# EasyEDA schematic audiobackboard.json
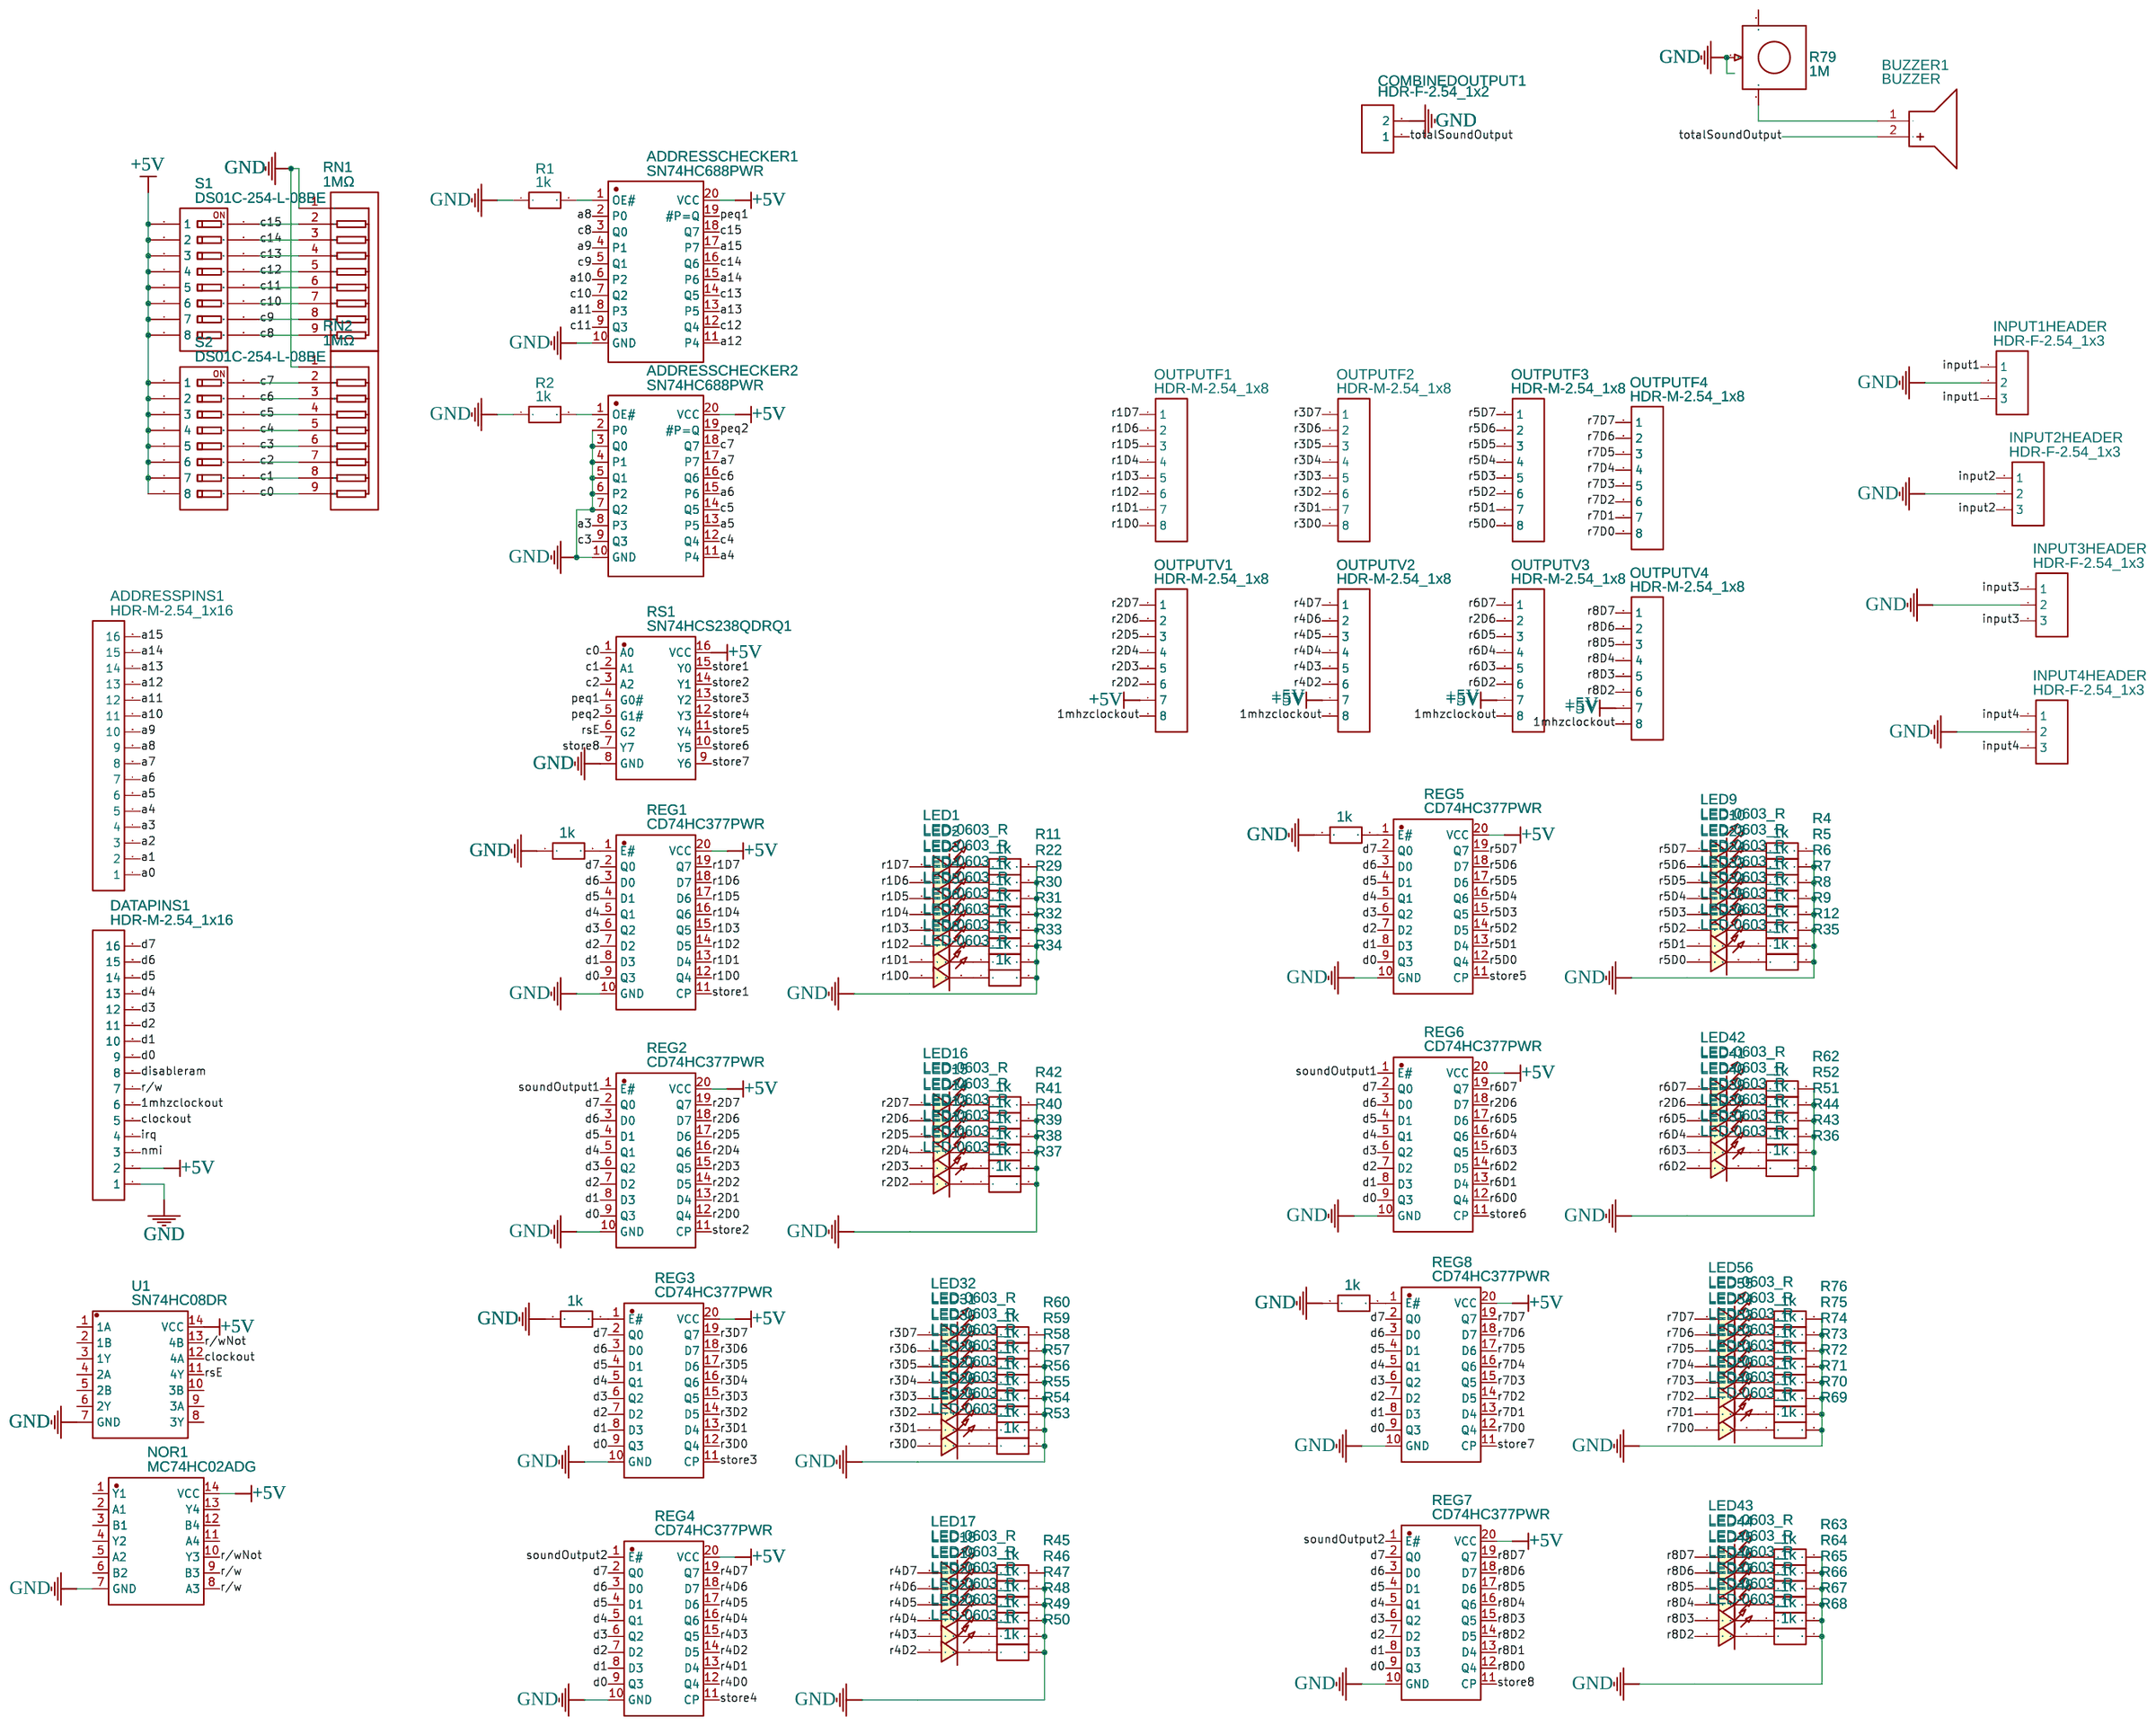
[diagram p0: schematic sheet]

## Parts
ADDRESSCHECKER1  SN74HC688PWR  [TSSOP-20_L6.5-W4.4-P0.65-LS6.4-BL]
ADDRESSCHECKER2  SN74HC688PWR  [TSSOP-20_L6.5-W4.4-P0.65-LS6.4-BL]
ADDRESSPINS1  HDR-M-2.54_1x16  [HDR-M-2.54_1X16]
BUZZER1  BUZZER  [BUZ-TH_BD12.0-P6.00-D0.9-RD]
COMBINEDOUTPUT1  HDR-F-2.54_1x2  [HDR-F-2.54_1X2]
DATAPINS1  HDR-M-2.54_1x16  [HDR-M-2.54_1X16]
INPUT1HEADER  HDR-F-2.54_1x3  [HDR-F-2.54_1X3]
INPUT2HEADER  HDR-F-2.54_1x3  [HDR-F-2.54_1X3]
INPUT3HEADER  HDR-F-2.54_1x3  [HDR-F-2.54_1X3]
INPUT4HEADER  HDR-F-2.54_1x3  [HDR-F-2.54_1X3]
LED1  LED-0603_R  [LED0603_RED]
LED2  LED-0603_R  [LED0603_RED]
LED3  LED-0603_R  [LED0603_RED]
LED4  LED-0603_R  [LED0603_RED]
LED5  LED-0603_R  [LED0603_RED]
LED6  LED-0603_R  [LED0603_RED]
LED7  LED-0603_R  [LED0603_RED]
LED8  LED-0603_R  [LED0603_RED]
LED9  LED-0603_R  [LED0603_RED]
LED10  LED-0603_R  [LED0603_RED]
LED11  LED-0603_R  [LED0603_RED]
LED12  LED-0603_R  [LED0603_RED]
LED13  LED-0603_R  [LED0603_RED]
LED14  LED-0603_R  [LED0603_RED]
LED15  LED-0603_R  [LED0603_RED]
LED16  LED-0603_R  [LED0603_RED]
LED17  LED-0603_R  [LED0603_RED]
LED18  LED-0603_R  [LED0603_RED]
LED19  LED-0603_R  [LED0603_RED]
LED20  LED-0603_R  [LED0603_RED]
LED21  LED-0603_R  [LED0603_RED]
LED22  LED-0603_R  [LED0603_RED]
LED23  LED-0603_R  [LED0603_RED]
LED24  LED-0603_R  [LED0603_RED]
LED25  LED-0603_R  [LED0603_RED]
LED26  LED-0603_R  [LED0603_RED]
LED27  LED-0603_R  [LED0603_RED]
LED28  LED-0603_R  [LED0603_RED]
LED29  LED-0603_R  [LED0603_RED]
LED30  LED-0603_R  [LED0603_RED]
LED31  LED-0603_R  [LED0603_RED]
LED32  LED-0603_R  [LED0603_RED]
LED33  LED-0603_R  [LED0603_RED]
LED34  LED-0603_R  [LED0603_RED]
LED35  LED-0603_R  [LED0603_RED]
LED36  LED-0603_R  [LED0603_RED]
LED37  LED-0603_R  [LED0603_RED]
LED38  LED-0603_R  [LED0603_RED]
LED39  LED-0603_R  [LED0603_RED]
LED40  LED-0603_R  [LED0603_RED]
LED41  LED-0603_R  [LED0603_RED]
LED42  LED-0603_R  [LED0603_RED]
LED43  LED-0603_R  [LED0603_RED]
LED44  LED-0603_R  [LED0603_RED]
LED45  LED-0603_R  [LED0603_RED]
LED46  LED-0603_R  [LED0603_RED]
LED47  LED-0603_R  [LED0603_RED]
LED48  LED-0603_R  [LED0603_RED]
LED49  LED-0603_R  [LED0603_RED]
LED50  LED-0603_R  [LED0603_RED]
LED51  LED-0603_R  [LED0603_RED]
LED52  LED-0603_R  [LED0603_RED]
LED53  LED-0603_R  [LED0603_RED]
LED54  LED-0603_R  [LED0603_RED]
LED55  LED-0603_R  [LED0603_RED]
LED56  LED-0603_R  [LED0603_RED]
NOR1  MC74HC02ADG  [SOIC-14_L8.7-W3.9-P1.27-LS6.0-BL]
OUTPUTF1  HDR-M-2.54_1x8  [HDR-M-2.54_1X8]
OUTPUTF2  HDR-M-2.54_1x8  [HDR-M-2.54_1X8]
OUTPUTF3  HDR-M-2.54_1x8  [HDR-M-2.54_1X8]
OUTPUTF4  HDR-M-2.54_1x8  [HDR-M-2.54_1X8]
OUTPUTV1  HDR-M-2.54_1x8  [HDR-M-2.54_1X8]
OUTPUTV2  HDR-M-2.54_1x8  [HDR-M-2.54_1X8]
OUTPUTV3  HDR-M-2.54_1x8  [HDR-M-2.54_1X8]
OUTPUTV4  HDR-M-2.54_1x8  [HDR-M-2.54_1X8]
R1  1k  [R1206]
R2  1k  [R1206]
R3  1k  [R1206]
R4  1k  [R1206]
R5  1k  [R1206]
R6  1k  [R1206]
R7  1k  [R1206]
R8  1k  [R1206]
R9  1k  [R1206]
R11  1k  [R1206]
R12  1k  [R1206]
R22  1k  [R1206]
R29  1k  [R1206]
R30  1k  [R1206]
R31  1k  [R1206]
R32  1k  [R1206]
R33  1k  [R1206]
R34  1k  [R1206]
R35  1k  [R1206]
R36  1k  [R1206]
R37  1k  [R1206]
R38  1k  [R1206]
R39  1k  [R1206]
R40  1k  [R1206]
R41  1k  [R1206]
R42  1k  [R1206]
R43  1k  [R1206]
R44  1k  [R1206]
R45  1k  [R1206]
R46  1k  [R1206]
R47  1k  [R1206]
R48  1k  [R1206]
R49  1k  [R1206]
R50  1k  [R1206]
R51  1k  [R1206]
R52  1k  [R1206]
R53  1k  [R1206]
R54  1k  [R1206]
R55  1k  [R1206]
R56  1k  [R1206]
R57  1k  [R1206]
R58  1k  [R1206]
R59  1k  [R1206]
R60  1k  [R1206]
R61  1k  [R1206]
R62  1k  [R1206]
R63  1k  [R1206]
R64  1k  [R1206]
R65  1k  [R1206]
R66  1k  [R1206]
R67  1k  [R1206]
R68  1k  [R1206]
R69  1k  [R1206]
R70  1k  [R1206]
R71  1k  [R1206]
R72  1k  [R1206]
R73  1k  [R1206]
R74  1k  [R1206]
R75  1k  [R1206]
R76  1k  [R1206]
R77  1k  [R1206]
R78  1k  [R1206]
R79  1M  [3386T]
REG1  CD74HC377PWR  [TSSOP-20_L6.5-W4.4-P0.65-LS6.4-BL]
REG2  CD74HC377PWR  [TSSOP-20_L6.5-W4.4-P0.65-LS6.4-BL]
REG3  CD74HC377PWR  [TSSOP-20_L6.5-W4.4-P0.65-LS6.4-BL]
REG4  CD74HC377PWR  [TSSOP-20_L6.5-W4.4-P0.65-LS6.4-BL]
REG5  CD74HC377PWR  [TSSOP-20_L6.5-W4.4-P0.65-LS6.4-BL]
REG6  CD74HC377PWR  [TSSOP-20_L6.5-W4.4-P0.65-LS6.4-BL]
REG7  CD74HC377PWR  [TSSOP-20_L6.5-W4.4-P0.65-LS6.4-BL]
REG8  CD74HC377PWR  [TSSOP-20_L6.5-W4.4-P0.65-LS6.4-BL]
RN1  1MΩ  [RES-ARRAY-TH_9P-P2.54-D1.0]
RN2  1MΩ  [RES-ARRAY-TH_9P-P2.54-D1.0]
RS1  SN74HCS238QDRQ1  [SOIC-16_L9.9-W3.9-P1.27-LS6.0-BL]
S1  DS01C-254-L-08BE  [DS01C-254-L-08BE]
S2  DS01C-254-L-08BE  [DS01C-254-L-08BE]
U1  SN74HC08DR  [SOIC-14_L8.7-W3.9-P1.27-LS6.0-BL]

## Library data of the parts
ADDRESSCHECKER1 ADDRESSCHECKER2 = SN74HC688PWR: Contributor: LCSC; Supplier: LCSC; Manufacturer: TI(德州仪器); Supplier Part: C132045; JLCPCB Part Class: Extended Part; link: https://lcsc.com/eda_search?q=C132045&%26type=1&ref=editor
ADDRESSPINS1 DATAPINS1 = HDR-M-2.54_1x16: Supplier: LCSC; Contributor: LCEDA_Lib
BUZZER1 = BUZZER: Contributor: lcsc; Supplier: LCSC; Supplier Part: C9900014030; Manufacturer: null; Manufacturer Part: buzzer; JLCPCB Part Class: Extended Part; link: https://lcsc.com/eda_search?q=C9900014030&%26type=1&ref=editor
COMBINEDOUTPUT1 = HDR-F-2.54_1x2: Supplier Part: C49661; Supplier: LCSC; Contributor: LCEDA_Lib
INPUT1HEADER INPUT2HEADER INPUT3HEADER INPUT4HEADER = HDR-F-2.54_1x3: Supplier Part: C146690; Supplier: LCSC; Contributor: LCEDA_Lib
LED1-LED56 = LED-0603_R: Manufacturer: EVERLIGHT(台湾亿光); Manufacturer Part: 19-217/R6C-AL1M2VY/3T; Supplier Part: C72044; Supplier: LCSC; Contributor: LCEDA_01
NOR1 = MC74HC02ADG: Contributor: LCSC; Supplier: LCSC; Supplier Part: C233598; Manufacturer: onsemi(安森美); JLCPCB Part Class: Extended Part; link: https://lcsc.com/eda_search?q=C233598&%26type=1&ref=editor
OUTPUTF1-OUTPUTF4 OUTPUTV1-OUTPUTV4 = HDR-M-2.54_1x8: Supplier Part: C190820; Supplier: LCSC; Contributor: LCEDA_Lib
R1-R9 R11 R12 R22 R29-R78 = R_1206_EU: Contributor: LCEDA_Lib
R79 = 3/8 Inch Square Cermet Potentiometer 1MEG Ohms 1/2 Watt 1 Turn Thru Hole: Manufacturer: Jameco ValuePro; Manufacturer Part: 3386T-1-LS1MEG(105); Supplier Part: 2161422; link: https://www.jameco.com/webapp/wcs/stores/servlet/ProductDisplay?storeId=10001&langId=-1&catalogId=10001&productId=2161422; Contributor: dissy614
REG1-REG8 = CD74HC377PWR: Contributor: LCSC; Supplier: LCSC; Supplier Part: C2677832; Manufacturer: TI(德州仪器); JLCPCB Part Class: Extended Part; link: https://lcsc.com/eda_search?q=C2677832&%26type=1&ref=editor
RN1 RN2 = 4609X-101-105LF: Supplier: LCSC; Supplier Part: C1358086; Manufacturer: BOURNS; JLCPCB Part Class: Extended Part; Contributor: lcsc
RS1 = SN74HCS238QDRQ1: Contributor: lcsc; Supplier: LCSC; Supplier Part: C2878562; Manufacturer: TI(德州仪器); link: https://lcsc.com/eda_search?q=C2878562&%26type=1&ref=editor
S1 S2 = DS01C-254-L-08BE: Manufacturer: CUI Devices; Manufacturer Part: DS01C-254-L-07BE; Supplier: Mouser; Supplier Part: 490-DS01C-254-L-07BE; link: https://www.mouser.com/datasheet/2/670/ds01-254-1777712.pdf; Contributor: CK Sim
U1 = SN74HC08DR: Contributor: LCSC; Supplier: LCSC; Supplier Part: C337768; Manufacturer: TI(德州仪器); JLCPCB Part Class: Extended Part; link: https://lcsc.com/eda_search?q=C337768&%26type=1&ref=editor

## Nets
+5V: ADDRESSCHECKER1.20(VCC) ADDRESSCHECKER2.20(VCC) DATAPINS1.2 NOR1.14(VCC) OUTPUTV1.7 OUTPUTV2.7 OUTPUTV3.7 OUTPUTV4.7 REG1.20(VCC) REG2.20(VCC) REG3.20(VCC) REG4.20(VCC) REG5.20(VCC) REG6.20(VCC) REG7.20(VCC) REG8.20(VCC) RS1.16(VCC) S1.1 S1.2 S1.3 S1.4 S1.5 S1.6 S1.7 S1.8 S2.1 S2.2 S2.3 S2.4 S2.5 S2.6 S2.7 S2.8 U1.14(VCC)
GND: ADDRESSCHECKER1.10(GND) ADDRESSCHECKER2.2(P0) ADDRESSCHECKER2.3(Q0) ADDRESSCHECKER2.4(P1) ADDRESSCHECKER2.5(Q1) ADDRESSCHECKER2.6(P2) ADDRESSCHECKER2.7(Q2) ADDRESSCHECKER2.10(GND) COMBINEDOUTPUT1.2 DATAPINS1.1 INPUT1HEADER.2 INPUT2HEADER.2 INPUT3HEADER.2 INPUT4HEADER.2 NOR1.7(GND) R1.1 R2.1 R3.1 R4.2 R5.2 R6.2 R7.2 R8.2 R9.2 R11.2 R12.2 R22.2 R29.2 R30.2 R31.2 R32.2 R33.2 R34.2 R35.2 R36.2 R37.2 R38.2 R39.2 R40.2 R41.2 R42.2 R43.2 R44.2 R45.2 R46.2 R47.2 R48.2 R49.2 R50.2 R51.2 R52.2 R53.2 R54.2 R55.2 R56.2 R57.2 R58.2 R59.2 R60.2 R61.1 R62.2 R63.2 R64.2 R65.2 R66.2 R67.2 R68.2 R69.2 R70.2 R71.2 R72.2 R73.2 R74.2 R75.2 R76.2 R77.1 R78.1 R79.2 REG1.10(GND) REG2.10(GND) REG3.10(GND) REG4.10(GND) REG5.10(GND) REG6.10(GND) REG7.10(GND) REG8.10(GND) RN1.1 RN2.1 RS1.8(GND) U1.7(GND)
1mhzclockout: DATAPINS1.6 OUTPUTV1.8 OUTPUTV2.8 OUTPUTV3.8 OUTPUTV4.8
a0: ADDRESSPINS1.1
a1: ADDRESSPINS1.2
a2: ADDRESSPINS1.3
a3: ADDRESSCHECKER2.8(P3) ADDRESSPINS1.4
a4: ADDRESSCHECKER2.11(P4) ADDRESSPINS1.5
a5: ADDRESSCHECKER2.13(P5) ADDRESSPINS1.6
a6: ADDRESSCHECKER2.15(P6) ADDRESSPINS1.7
a7: ADDRESSCHECKER2.17(P7) ADDRESSPINS1.8
a8: ADDRESSCHECKER1.2(P0) ADDRESSPINS1.9
a9: ADDRESSCHECKER1.4(P1) ADDRESSPINS1.10
a10: ADDRESSCHECKER1.6(P2) ADDRESSPINS1.11
a11: ADDRESSCHECKER1.8(P3) ADDRESSPINS1.12
a12: ADDRESSCHECKER1.11(P4) ADDRESSPINS1.13
a13: ADDRESSCHECKER1.13(P5) ADDRESSPINS1.14
a14: ADDRESSCHECKER1.15(P6) ADDRESSPINS1.15
a15: ADDRESSCHECKER1.17(P7) ADDRESSPINS1.16
c0: RN2.9 RS1.1(A0) S2.9
c1: RN2.8 RS1.2(A1) S2.10
c2: RN2.7 RS1.3(A2) S2.11
c3: ADDRESSCHECKER2.9(Q3) RN2.6 S2.12
c4: ADDRESSCHECKER2.12(Q4) RN2.5 S2.13
c5: ADDRESSCHECKER2.14(Q5) RN2.4 S2.14
c6: ADDRESSCHECKER2.16(Q6) RN2.3 S2.15
c7: ADDRESSCHECKER2.18(Q7) RN2.2 S2.16
c8: ADDRESSCHECKER1.3(Q0) RN1.9 S1.9
c9: ADDRESSCHECKER1.5(Q1) RN1.8 S1.10
c10: ADDRESSCHECKER1.7(Q2) RN1.7 S1.11
c11: ADDRESSCHECKER1.9(Q3) RN1.6 S1.12
c12: ADDRESSCHECKER1.12(Q4) RN1.5 S1.13
c13: ADDRESSCHECKER1.14(Q5) RN1.4 S1.14
c14: ADDRESSCHECKER1.16(Q6) RN1.3 S1.15
c15: ADDRESSCHECKER1.18(Q7) RN1.2 S1.16
clockout: DATAPINS1.5 U1.12(4A)
d0: DATAPINS1.9 REG1.9(Q3) REG2.9(Q3) REG3.9(Q3) REG4.9(Q3) REG5.9(Q3) REG6.9(Q3) REG7.9(Q3) REG8.9(Q3)
d1: DATAPINS1.10 REG1.8(D3) REG2.8(D3) REG3.8(D3) REG4.8(D3) REG5.8(D3) REG6.8(D3) REG7.8(D3) REG8.8(D3)
d2: DATAPINS1.11 REG1.7(D2) REG2.7(D2) REG3.7(D2) REG4.7(D2) REG5.7(D2) REG6.7(D2) REG7.7(D2) REG8.7(D2)
d3: DATAPINS1.12 REG1.6(Q2) REG2.6(Q2) REG3.6(Q2) REG4.6(Q2) REG5.6(Q2) REG6.6(Q2) REG7.6(Q2) REG8.6(Q2)
d4: DATAPINS1.13 REG1.5(Q1) REG2.5(Q1) REG3.5(Q1) REG4.5(Q1) REG5.5(Q1) REG6.5(Q1) REG7.5(Q1) REG8.5(Q1)
d5: DATAPINS1.14 REG1.4(D1) REG2.4(D1) REG3.4(D1) REG4.4(D1) REG5.4(D1) REG6.4(D1) REG7.4(D1) REG8.4(D1)
d6: DATAPINS1.15 REG1.3(D0) REG2.3(D0) REG3.3(D0) REG4.3(D0) REG5.3(D0) REG6.3(D0) REG7.3(D0) REG8.3(D0)
d7: DATAPINS1.16 REG1.2(Q0) REG2.2(Q0) REG3.2(Q0) REG4.2(Q0) REG5.2(Q0) REG6.2(Q0) REG7.2(Q0) REG8.2(Q0)
disableram: DATAPINS1.8
input1: INPUT1HEADER.1 INPUT1HEADER.3
input2: INPUT2HEADER.1 INPUT2HEADER.3
input3: INPUT3HEADER.1 INPUT3HEADER.3
input4: INPUT4HEADER.1 INPUT4HEADER.3
irq: DATAPINS1.4
nmi: DATAPINS1.3
peq1: ADDRESSCHECKER1.19(#P=Q) RS1.4(G0#)
peq2: ADDRESSCHECKER2.19(#P=Q) RS1.5(G1#)
r1D0: LED8.1 OUTPUTF1.8 REG1.12(Q4)
r1D1: LED7.1 OUTPUTF1.7 REG1.13(D4)
r1D2: LED6.1 OUTPUTF1.6 REG1.14(D5)
r1D3: LED5.1 OUTPUTF1.5 REG1.15(Q5)
r1D4: LED4.1 OUTPUTF1.4 REG1.16(Q6)
r1D5: LED3.1 OUTPUTF1.3 REG1.17(D6)
r1D6: LED2.1 OUTPUTF1.2 REG1.18(D7)
r1D7: LED1.1 OUTPUTF1.1 REG1.19(Q7)
r2D0: REG2.12(Q4)
r2D1: REG2.13(D4)
r2D2: LED11.1 OUTPUTV1.6 REG2.14(D5)
r2D3: LED12.1 OUTPUTV1.5 REG2.15(Q5)
r2D4: LED13.1 OUTPUTV1.4 REG2.16(Q6)
r2D5: LED14.1 OUTPUTV1.3 REG2.17(D6)
r2D6: LED15.1 LED41.1 OUTPUTV1.2 OUTPUTV3.2 REG2.18(D7) REG6.18(D7)
r2D7: LED16.1 OUTPUTV1.1 REG2.19(Q7)
r3D0: LED25.1 OUTPUTF2.8 REG3.12(Q4)
r3D1: LED26.1 OUTPUTF2.7 REG3.13(D4)
r3D2: LED27.1 OUTPUTF2.6 REG3.14(D5)
r3D3: LED28.1 OUTPUTF2.5 REG3.15(Q5)
r3D4: LED29.1 OUTPUTF2.4 REG3.16(Q6)
r3D5: LED30.1 OUTPUTF2.3 REG3.17(D6)
r3D6: LED31.1 OUTPUTF2.2 REG3.18(D7)
r3D7: LED32.1 OUTPUTF2.1 REG3.19(Q7)
r4D0: REG4.12(Q4)
r4D1: REG4.13(D4)
r4D2: LED22.1 OUTPUTV2.6 REG4.14(D5)
r4D3: LED21.1 OUTPUTV2.5 REG4.15(Q5)
r4D4: LED20.1 OUTPUTV2.4 REG4.16(Q6)
r4D5: LED19.1 OUTPUTV2.3 REG4.17(D6)
r4D6: LED18.1 OUTPUTV2.2 REG4.18(D7)
r4D7: LED17.1 OUTPUTV2.1 REG4.19(Q7)
r5D0: LED36.1 OUTPUTF3.8 REG5.12(Q4)
r5D1: LED35.1 OUTPUTF3.7 REG5.13(D4)
r5D2: LED34.1 OUTPUTF3.6 REG5.14(D5)
r5D3: LED33.1 OUTPUTF3.5 REG5.15(Q5)
r5D4: LED24.1 OUTPUTF3.4 REG5.16(Q6)
r5D5: LED23.1 OUTPUTF3.3 REG5.17(D6)
r5D6: LED10.1 OUTPUTF3.2 REG5.18(D7)
r5D7: LED9.1 OUTPUTF3.1 REG5.19(Q7)
r6D0: REG6.12(Q4)
r6D1: REG6.13(D4)
r6D2: LED37.1 OUTPUTV3.6 REG6.14(D5)
r6D3: LED38.1 OUTPUTV3.5 REG6.15(Q5)
r6D4: LED39.1 OUTPUTV3.4 REG6.16(Q6)
r6D5: LED40.1 OUTPUTV3.3 REG6.17(D6)
r6D7: LED42.1 OUTPUTV3.1 REG6.19(Q7)
r7D0: LED49.1 OUTPUTF4.8 REG8.12(Q4)
r7D1: LED50.1 OUTPUTF4.7 REG8.13(D4)
r7D2: LED51.1 OUTPUTF4.6 REG8.14(D5)
r7D3: LED52.1 OUTPUTF4.5 REG8.15(Q5)
r7D4: LED53.1 OUTPUTF4.4 REG8.16(Q6)
r7D5: LED54.1 OUTPUTF4.3 REG8.17(D6)
r7D6: LED55.1 OUTPUTF4.2 REG8.18(D7)
r7D7: LED56.1 OUTPUTF4.1 REG8.19(Q7)
r8D0: REG7.12(Q4)
r8D1: REG7.13(D4)
r8D2: LED48.1 OUTPUTV4.6 REG7.14(D5)
r8D3: LED47.1 OUTPUTV4.5 REG7.15(Q5)
r8D4: LED46.1 OUTPUTV4.4 REG7.16(Q6)
r8D5: LED45.1 OUTPUTV4.3 REG7.17(D6)
r8D6: LED44.1 OUTPUTV4.2 REG7.18(D7)
r8D7: LED43.1 OUTPUTV4.1 REG7.19(Q7)
r/w: DATAPINS1.7 NOR1.8(A3) NOR1.9(B3)
r/wNot: NOR1.10(Y3) U1.13(4B)
rsE: RS1.6(G2) U1.11(4Y)
soundOutput1: REG2.1(E#) REG6.1(E#)
soundOutput2: REG4.1(E#) REG7.1(E#)
store1: REG1.11(CP) RS1.15(Y0)
store2: REG2.11(CP) RS1.14(Y1)
store3: REG3.11(CP) RS1.13(Y2)
store4: REG4.11(CP) RS1.12(Y3)
store5: REG5.11(CP) RS1.11(Y4)
store6: REG6.11(CP) RS1.10(Y5)
store7: REG8.11(CP) RS1.9(Y6)
store8: REG7.11(CP) RS1.7(Y7)
totalSoundOutput: BUZZER1.2(+) COMBINEDOUTPUT1.1
Net-(ADDRESSCHECKER1-1): ADDRESSCHECKER1.1(OE#) R1.2
Net-(ADDRESSCHECKER2-1): ADDRESSCHECKER2.1(OE#) R2.2
Net-(BUZZER1-1): BUZZER1.1(-) R79.3
Net-(LED1-2): LED1.2 R11.1
Net-(LED2-2): LED2.2 R22.1
Net-(LED3-2): LED3.2 R29.1
Net-(LED4-2): LED4.2 R30.1
Net-(LED5-2): LED5.2 R31.1
Net-(LED6-2): LED6.2 R32.1
Net-(LED7-2): LED7.2 R33.1
Net-(LED8-2): LED8.2 R34.1
Net-(LED9-2): LED9.2 R4.1
Net-(LED10-2): LED10.2 R5.1
Net-(LED11-2): LED11.2 R37.1
Net-(LED12-2): LED12.2 R38.1
Net-(LED13-2): LED13.2 R39.1
Net-(LED14-2): LED14.2 R40.1
Net-(LED15-2): LED15.2 R41.1
Net-(LED16-2): LED16.2 R42.1
Net-(LED17-2): LED17.2 R45.1
Net-(LED18-2): LED18.2 R46.1
Net-(LED19-2): LED19.2 R47.1
Net-(LED20-2): LED20.2 R48.1
Net-(LED21-2): LED21.2 R49.1
Net-(LED22-2): LED22.2 R50.1
Net-(LED23-2): LED23.2 R6.1
Net-(LED24-2): LED24.2 R7.1
Net-(LED25-2): LED25.2 R53.1
Net-(LED26-2): LED26.2 R54.1
Net-(LED27-2): LED27.2 R55.1
Net-(LED28-2): LED28.2 R56.1
Net-(LED29-2): LED29.2 R57.1
Net-(LED30-2): LED30.2 R58.1
Net-(LED31-2): LED31.2 R59.1
Net-(LED32-2): LED32.2 R60.1
Net-(LED33-2): LED33.2 R8.1
Net-(LED34-2): LED34.2 R9.1
Net-(LED35-2): LED35.2 R12.1
Net-(LED36-2): LED36.2 R35.1
Net-(LED37-2): LED37.2 R36.1
Net-(LED38-2): LED38.2 R43.1
Net-(LED39-2): LED39.2 R44.1
Net-(LED40-2): LED40.2 R51.1
Net-(LED41-2): LED41.2 R52.1
Net-(LED42-2): LED42.2 R62.1
Net-(LED43-2): LED43.2 R63.1
Net-(LED44-2): LED44.2 R64.1
Net-(LED45-2): LED45.2 R65.1
Net-(LED46-2): LED46.2 R66.1
Net-(LED47-2): LED47.2 R67.1
Net-(LED48-2): LED48.2 R68.1
Net-(LED49-2): LED49.2 R69.1
Net-(LED50-2): LED50.2 R70.1
Net-(LED51-2): LED51.2 R71.1
Net-(LED52-2): LED52.2 R72.1
Net-(LED53-2): LED53.2 R73.1
Net-(LED54-2): LED54.2 R74.1
Net-(LED55-2): LED55.2 R75.1
Net-(LED56-2): LED56.2 R76.1
Net-(R3-2): R3.2 REG1.1(E#)
Net-(R61-2): R61.2 REG3.1(E#)
Net-(R77-2): R77.2 REG8.1(E#)
Net-(R78-2): R78.2 REG5.1(E#)

Not connected (* = marked no-connect by the designer): NOR1 1(Y1) 2(A1) 3(B1) 4(Y2) 5(A2) 6(B2) 11(A4) 12(B4) 13(Y4); R79 1; U1 1(1A) 2(1B) 3(1Y) 4(2A) 5(2B) 6(2Y) 8(3Y) 9(3A) 10(3B)

## Notes on the sheet
- +5V
- +5V
- +5V
